# Altium schematic sheet eVV_TopLevel TMC.SchDoc: eVV_TopLevel
size A4; DrawnBy: Ivica Matovic; Revision: 1.1; SheetNumber: 3; SheetTotal: 8
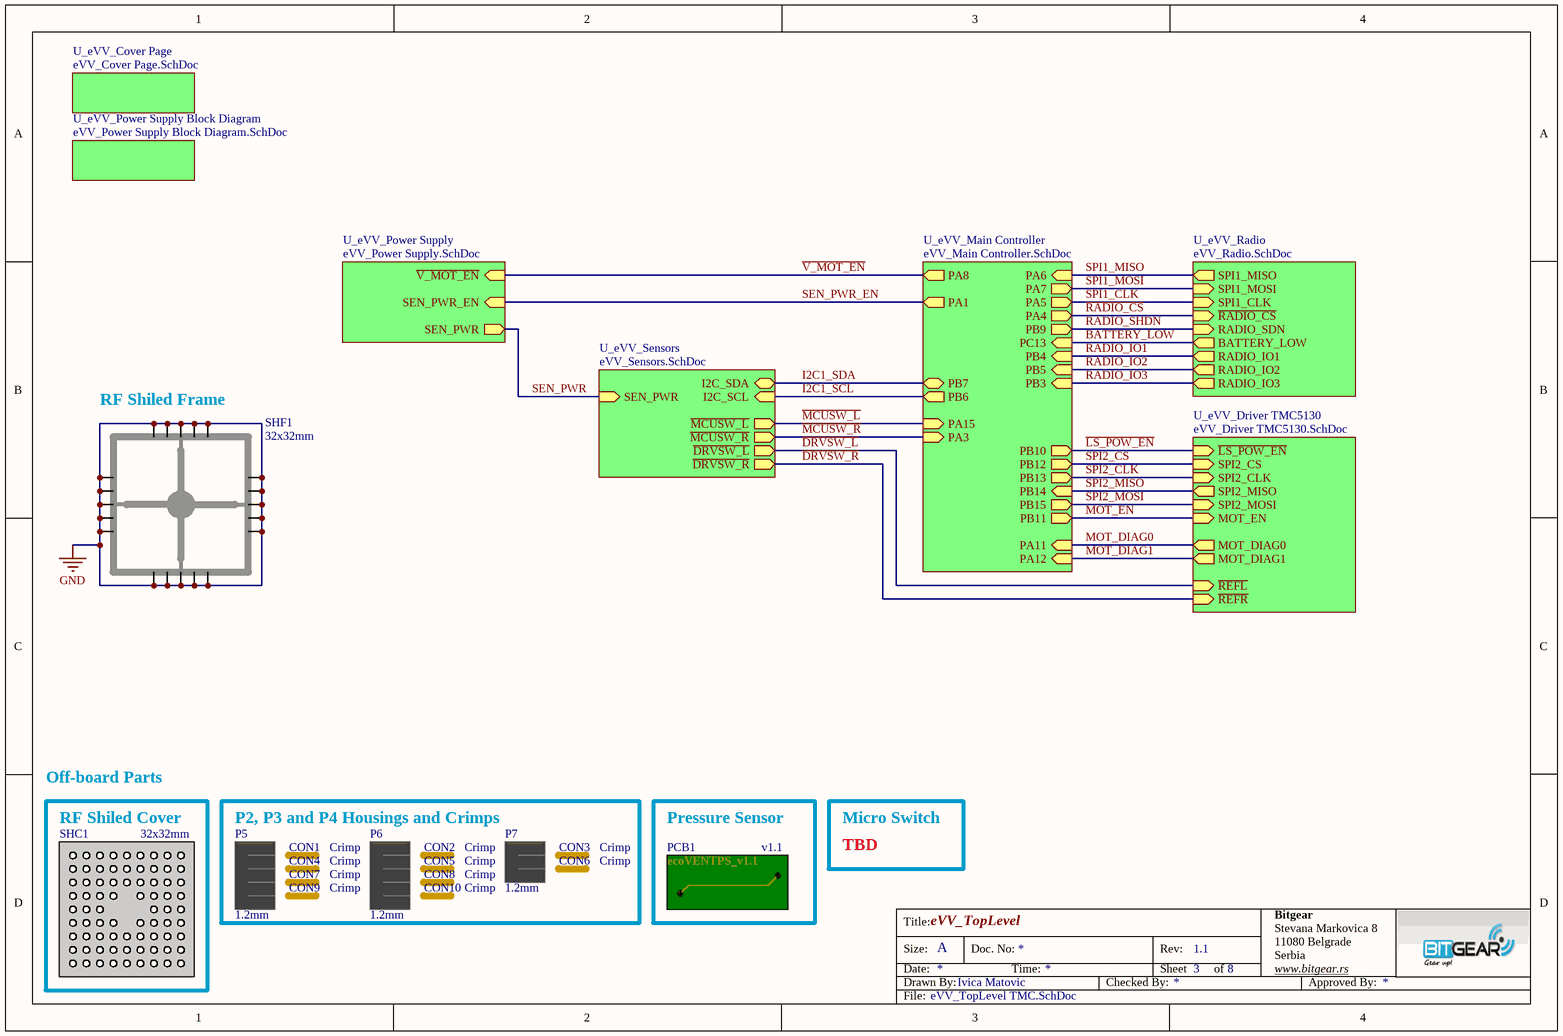
[diagram p0: eVV_TopLevel TMC.SchDoc]

## Parts
CON1  Crimp  (mechanical)
CON2  Crimp  (mechanical)
CON3  Crimp  (mechanical)
CON4  Crimp  (mechanical)
CON5  Crimp  (mechanical)
CON6  Crimp  (mechanical)
CON7  Crimp  (mechanical)
CON8  Crimp  (mechanical)
CON9  Crimp  (mechanical)
CON10  Crimp  (mechanical)
P5  1.2mm  (mechanical)
P6  1.2mm  (mechanical)
P7  1.2mm  (mechanical)
PCB1  v1.1  (mechanical)
SHC1  32x32mm  (mechanical)
SHF1  32x32mm  [BMI-S-204-F]

## Blocks framed on the sheet
P2, P3 and P4 Housings and Crimps: CON1-CON10 P5-P7
Pressure Sensor: PCB1

## Sub-sheets
U_eVV_Cover Page = eVV_Cover Page.SchDoc: no entries
U_eVV_Driver TMC5130 = eVV_Driver TMC5130.SchDoc: MOT_DIAG0 (out), MOT_DIAG1 (out), SPI2_CS (in), SPI2_CLK (in), SPI2_MOSI (in), MOT_EN (in), SPI2_MISO (out), ~{REFL} (in), ~{REFR} (in), ~{LS_POW_EN} (in)
U_eVV_Main Controller = eVV_Main Controller.SchDoc: PA4 (out), PB9 (out), PB7 (bidir), PB6 (out), PA1 (out), PA8 (out), PB10 (out), PC13 (in), PB12 (out), PB13 (out), PB15 (out), PB11 (out), PB5 (in), PB4 (in), PB3 (in), PA7 (out), PA5 (out), PA6 (in), PB14 (in), PA11 (in), PA12 (in), PA15 (in), PA3 (in)
U_eVV_Power Supply = eVV_Power Supply.SchDoc: ~{V_MOT_EN} (in), SEN_PWR_EN (in), SEN_PWR (out)
U_eVV_Power Supply Block Diagram = eVV_Power Supply Block Diagram.SchDoc: no entries
U_eVV_Radio = eVV_Radio.SchDoc: ~{RADIO_CS} (in), RADIO_SDN (in), BATTERY_LOW (out), RADIO_IO2 (out), RADIO_IO1 (out), RADIO_IO3 (out), SPI1_MOSI (in), SPI1_CLK (in), SPI1_MISO (out)
U_eVV_Sensors = eVV_Sensors.SchDoc: I2C_SDA (bidir), I2C_SCL (in), SEN_PWR (in), ~{MCUSW_L} (out), ~{MCUSW_R} (out), ~{DRVSW_L} (out), ~{DRVSW_R} (out)

## Nets
GND: SHF1.1(GND) SHF1.2(GND) SHF1.3(GND) SHF1.4(GND) SHF1.5(GND) SHF1.6(GND) SHF1.7(GND) SHF1.8(GND) SHF1.9(GND) SHF1.10(GND) SHF1.11(GND) SHF1.12(GND) SHF1.13(GND) SHF1.14(GND) SHF1.15(GND) SHF1.16(GND) SHF1.17(GND) SHF1.18(GND) SHF1.19(GND) SHF1.20(GND)
~{DRVSW_L}: sheet U_eVV_Sensors/~{DRVSW_L}, sheet U_eVV_Driver TMC5130/~{REFL}
~{DRVSW_R}: sheet U_eVV_Sensors/~{DRVSW_R}, sheet U_eVV_Driver TMC5130/~{REFR}
~{LS_POW_EN}: sheet U_eVV_Main Controller/PB10, sheet U_eVV_Driver TMC5130/~{LS_POW_EN}
~{MCUSW_L}: sheet U_eVV_Main Controller/PA15, sheet U_eVV_Sensors/~{MCUSW_L}
~{MCUSW_R}: sheet U_eVV_Main Controller/PA3, sheet U_eVV_Sensors/~{MCUSW_R}
~{V_MOT_EN}: sheet U_eVV_Power Supply/~{V_MOT_EN}, sheet U_eVV_Main Controller/PA8
BATTERY_LOW: sheet U_eVV_Main Controller/PC13, sheet U_eVV_Radio/BATTERY_LOW
I2C1_SCL: sheet U_eVV_Main Controller/PB6, sheet U_eVV_Sensors/I2C_SCL
I2C1_SDA: sheet U_eVV_Main Controller/PB7, sheet U_eVV_Sensors/I2C_SDA
MOT_DIAG0: sheet U_eVV_Main Controller/PA11, sheet U_eVV_Driver TMC5130/MOT_DIAG0
MOT_DIAG1: sheet U_eVV_Main Controller/PA12, sheet U_eVV_Driver TMC5130/MOT_DIAG1
MOT_EN: sheet U_eVV_Main Controller/PB11, sheet U_eVV_Driver TMC5130/MOT_EN
~{RADIO_CS}: sheet U_eVV_Main Controller/PA4, sheet U_eVV_Radio/~{RADIO_CS}
RADIO_IO1: sheet U_eVV_Main Controller/PB4, sheet U_eVV_Radio/RADIO_IO1
RADIO_IO2: sheet U_eVV_Main Controller/PB5, sheet U_eVV_Radio/RADIO_IO2
RADIO_IO3: sheet U_eVV_Main Controller/PB3, sheet U_eVV_Radio/RADIO_IO3
RADIO_SHDN: sheet U_eVV_Main Controller/PB9, sheet U_eVV_Radio/RADIO_SDN
SEN_PWR: sheet U_eVV_Power Supply/SEN_PWR, sheet U_eVV_Sensors/SEN_PWR
SEN_PWR_EN: sheet U_eVV_Power Supply/SEN_PWR_EN, sheet U_eVV_Main Controller/PA1
SPI1_CLK: sheet U_eVV_Main Controller/PA5, sheet U_eVV_Radio/SPI1_CLK
SPI1_MISO: sheet U_eVV_Main Controller/PA6, sheet U_eVV_Radio/SPI1_MISO
SPI1_MOSI: sheet U_eVV_Main Controller/PA7, sheet U_eVV_Radio/SPI1_MOSI
SPI2_CLK: sheet U_eVV_Main Controller/PB13, sheet U_eVV_Driver TMC5130/SPI2_CLK
SPI2_CS: sheet U_eVV_Main Controller/PB12, sheet U_eVV_Driver TMC5130/SPI2_CS
SPI2_MISO: sheet U_eVV_Main Controller/PB14, sheet U_eVV_Driver TMC5130/SPI2_MISO
SPI2_MOSI: sheet U_eVV_Main Controller/PB15, sheet U_eVV_Driver TMC5130/SPI2_MOSI

## Notes on the sheet
- (near SHF1) RF Shiled Frame
- Off-board Parts
- (near SHC1) RF Shiled Cover
- Micro Switch
- TBD
- Title:
- Bitgear
- Size:
- Date:
- Drawn By:
- A
- Doc. No:
- Time:
- Checked By:
- Sheet
- Rev:
- of
- Stevana Markovica 8
- 11080 Belgrade
- Serbia
- www.bitgear.rs
- Approved By:
- File:
- (in symbol PCB PS v1.1) ecoVENTPS_v1.1

## Library data of the parts
CON1-CON10 = 0781720410: Molex Contact for Pico-EZmate; D P/N: WM3992CT-ND; D Price: 0.16; S MOQ: 1000; S Price: 0.069; Value: 28-30AWG; Distributor: Digikey; Manufacturer: Molex; M P/N: 0781720410; S P/N: WM3992CT-ND; Supplier: Digi Key
P5 P6 = Receptacle MOLEX Pico-EZmate 1X4 1.2mm: 1.2mm pitch Pico-EZmate, Wire to Board, Vertical, with Locks, 1X4; Manufacturer: Molex; D P/N: WM4362-ND; D Price: 0.27; M P/N: 078172-0004; S MOQ: 1000; S Price: 0.12; Distributor: Digikey; Mounting: SMD; S P/N: WM4362-ND; Supplier: Digi Key; Value: 1X4
P7 = Receptacle MOLEX Pico-EZmate 1X2 1.2mm: 1.2mm pitch Pico-EZmate, Wire to Board, Vertical, with Locks, 1X2; Manufacturer: Molex; D P/N: WM4348-ND; D Price: 0.21; M P/N: 0781720002; S MOQ: 1000; S Price: 0.0963; Distributor: Digikey; Mounting: SMD; S P/N: WM4348-ND; Supplier: Digi Key; Value: 1X2
PCB1 = PCB PS v1.1: ecoVENT Pressure Sensor Board; Value: v1.1
SHC1 = BMI-S-204-C: Board Level Shield 32X32mm, 6mm Height, Cover; Manufacturer: Laird Techologies EMI; D P/N: 903-1016-ND; D Price: 2.29; S MOQ: 1000; S Price: 1.07; Distributor: Digikey; M P/N: BMI-S-204-C; Mounting: SMD; Supplier: Digi Key; S P/N: 903-1016-ND; Value: 6mm
SHF1 = BMI-S-204-F: Board Level Shield 32X32mm, 6mm Height, Frame; Manufacturer: Laird Techologies EMI; D P/N: 903-1053-1-ND; D Price: 2.38; S MOQ: 100; S Price: 1.73; Distributor: Digikey; M P/N: BMI-S-204-F; Mounting: SMD; Supplier: Digi Key; S P/N: 903-1053-1-ND; Value: 6mm